# Altium project display.PRJPCB
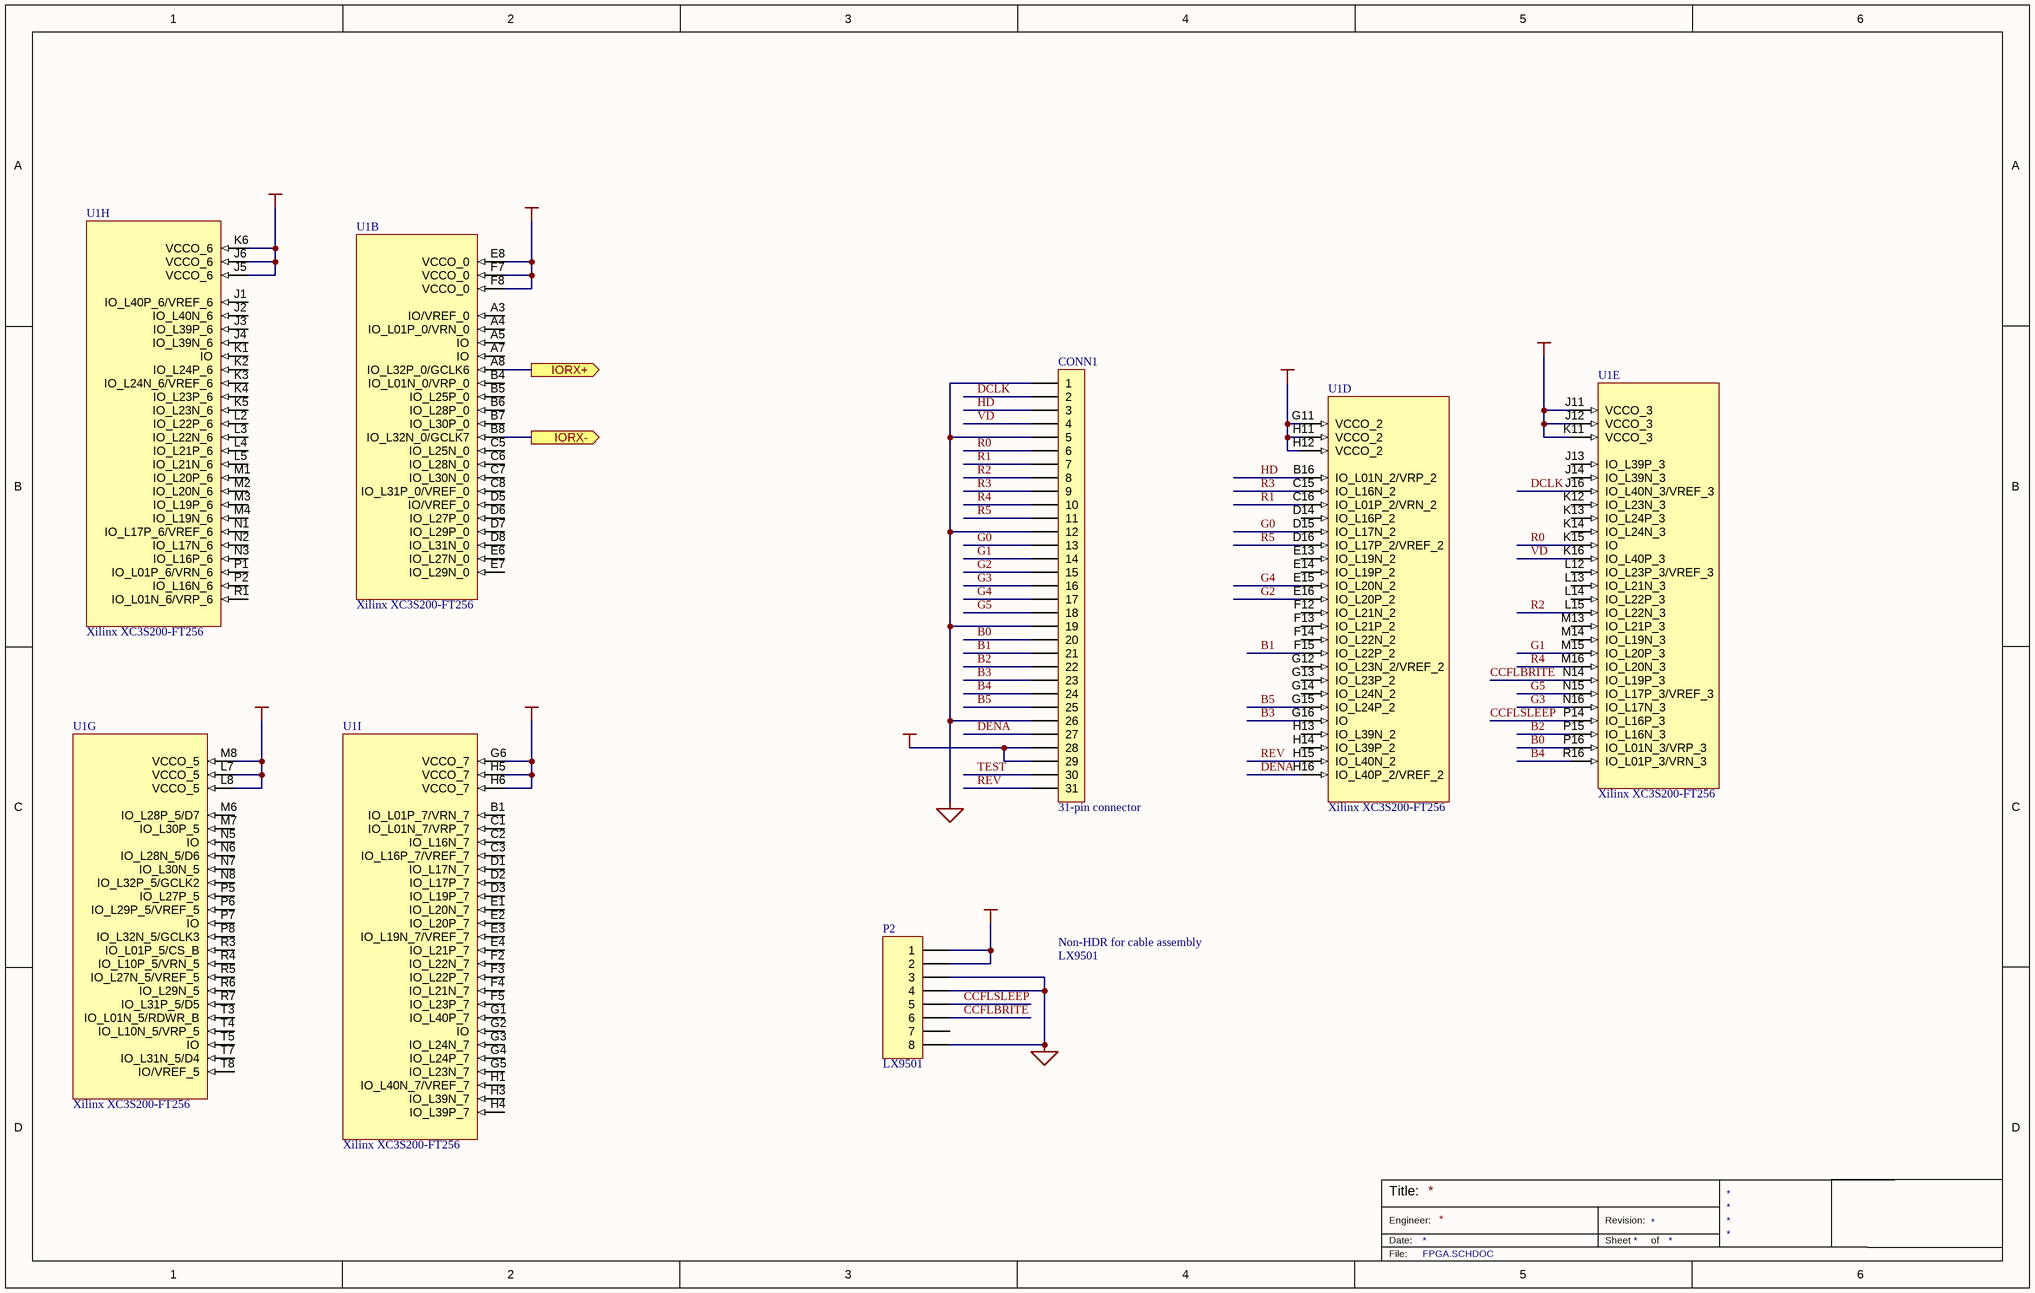
[diagram p0: FPGA.SCHDOC]
3 sheets, 66 parts. Net scope: flat (ports and power ports of the same name join across sheets).
Board file: display.PCBDOC
Sheets:
  FPGA.SCHDOC
  power.SCHDOC
  SERIALIO.SCHDOC

## Sheet FPGA.SCHDOC
size B

### Parts
CONN1  31-pin connector  [DF9A-31S-1V]
P2  LX9501  [HDR1X8]
U1  Xilinx XC3S200-FT256  [Xilinx FT256 BGA]  (parts B,D,E,G,H,I of 9)

### Ports
IORX+ (out), IORX- (out)

### Nets
+2.5VCC: U1.E8(VCCO_0) U1.F7(VCCO_0) U1.F8(VCCO_0)
+12VCC: P2.1 P2.2
GND: CONN1.1 CONN1.5 CONN1.12 CONN1.19 CONN1.26 P2.3 P2.4 P2.8
VCC: CONN1.28 CONN1.29 U1.G6(VCCO_7) U1.G11(VCCO_2) U1.H5(VCCO_7) U1.H6(VCCO_7) U1.H11(VCCO_2) U1.H12(VCCO_2) U1.J5(VCCO_6) U1.J6(VCCO_6) U1.J11(VCCO_3) U1.J12(VCCO_3) U1.K6(VCCO_6) U1.K11(VCCO_3) U1.L7(VCCO_5) U1.L8(VCCO_5) U1.M8(VCCO_5)
B0: CONN1.20 U1.P16(IO_L01N_3/VRP_3)
B1: CONN1.21 U1.F15(IO_L22P_2)
B2: CONN1.22 U1.P15(IO_L16N_3)
B3: CONN1.23 U1.G16(IO)
B4: CONN1.24 U1.R16(IO_L01P_3/VRN_3)
B5: CONN1.25 U1.G15(IO_L24P_2)
CCFLBRITE: P2.6 U1.N14(IO_L19P_3)
CCFLSLEEP: P2.5 U1.P14(IO_L16P_3)
DCLK: CONN1.2 U1.J16(IO_L40N_3/VREF_3)
DENA: CONN1.27 U1.H16(IO_L40P_2/VREF_2)
G0: CONN1.13 U1.D15(IO_L17N_2)
G1: CONN1.14 U1.M15(IO_L20P_3)
G2: CONN1.15 U1.E16(IO_L20P_2)
G3: CONN1.16 U1.N16(IO_L17N_3)
G4: CONN1.17 U1.E15(IO_L20N_2)
G5: CONN1.18 U1.N15(IO_L17P_3/VREF_3)
HD: CONN1.3 U1.B16(IO_L01N_2/VRP_2)
IORX+: U1.A8(IO_L32P_0/GCLK6) ; port IORX+
IORX-: U1.B8(IO_L32N_0/GCLK7) ; port IORX-
R0: CONN1.6 U1.K15(IO)
R1: CONN1.7 U1.C16(IO_L01P_2/VRN_2)
R2: CONN1.8 U1.L15(IO_L22N_3)
R3: CONN1.9 U1.C15(IO_L16N_2)
R4: CONN1.10 U1.M16(IO_L20N_3)
R5: CONN1.11 U1.D16(IO_L17P_2/VREF_2)
REV: CONN1.31 U1.H15(IO_L40N_2)
TEST: CONN1.30
VD: CONN1.4 U1.K16(IO_L40P_3)

Not connected (* = marked no-connect by the designer): P2 7; U1 A3(IO/VREF_0) A4(IO_L01P_0/VRN_0) A5(IO) A7(IO) B1(IO_L01P_7/VRN_7) B4(IO_L01N_0/VRP_0) B5(IO_L25P_0) B6(IO_L28P_0) B7(IO_L30P_0) C1(IO_L01N_7/VRP_7) C2(IO_L16N_7) C3(IO_L16P_7/VREF_7) C5(IO_L25N_0) C6(IO_L28N_0) C7(IO_L30N_0) C8(IO_L31P_0/VREF_0) D1(IO_L17N_7) D2(IO_L17P_7) D3(IO_L19P_7) D5(IO/VREF_0) D6(IO_L27P_0) D7(IO_L29P_0) D8(IO_L31N_0) D14(IO_L16P_2) E1(IO_L20N_7) E2(IO_L20P_7) E3(IO_L19N_7/VREF_7) E4(IO_L21P_7) E6(IO_L27N_0) E7(IO_L29N_0) E13(IO_L19N_2) E14(IO_L19P_2) F2(IO_L22N_7) F3(IO_L22P_7) F4(IO_L21N_7) F5(IO_L23P_7) F12(IO_L21N_2) F13(IO_L21P_2) F14(IO_L22N_2) G1(IO_L40P_7) G2(IO) G3(IO_L24N_7) G4(IO_L24P_7) G5(IO_L23N_7) G12(IO_L23N_2/VREF_2) G13(IO_L23P_2) G14(IO_L24N_2) H1(IO_L40N_7/VREF_7) H3(IO_L39N_7) H4(IO_L39P_7) H13(IO_L39N_2) H14(IO_L39P_2) J1(IO_L40P_6/VREF_6) J2(IO_L40N_6) J3(IO_L39P_6) J4(IO_L39N_6) J13(IO_L39P_3) J14(IO_L39N_3) K1(IO) K2(IO_L24P_6) K3(IO_L24N_6/VREF_6) K4(IO_L23P_6) K5(IO_L23N_6) K12(IO_L23N_3) K13(IO_L24P_3) K14(IO_L24N_3) L2(IO_L22P_6) L3(IO_L22N_6) L4(IO_L21P_6) L5(IO_L21N_6) L12(IO_L23P_3/VREF_3) L13(IO_L21N_3) L14(IO_L22P_3) M1(IO_L20P_6) M2(IO_L20N_6) M3(IO_L19P_6) M4(IO_L19N_6) M6(IO_L28P_5/D7) M7(IO_L30P_5) M13(IO_L21P_3) M14(IO_L19N_3) N1(IO_L17P_6/VREF_6) N2(IO_L17N_6) N3(IO_L16P_6) N5(IO) N6(IO_L28N_5/D6) N7(IO_L30N_5) N8(IO_L32P_5/GCLK2) P1(IO_L01P_6/VRN_6) P2(IO_L16N_6) P5(IO_L27P_5) P6(IO_L29P_5/VREF_5) P7(IO) P8(IO_L32N_5/GCLK3) R1(IO_L01N_6/VRP_6) R3(IO_L01P_5/CS_B) R4(IO_L10P_5/VRN_5) R5(IO_L27N_5/VREF_5) R6(IO_L29N_5) R7(IO_L31P_5/D5) T3(IO_L01N_5/RDWR_B) T4(IO_L10N_5/VRP_5) T5(IO) T7(IO_L31N_5/D4) T8(IO/VREF_5)

### Notes on the sheet
- Non-HDR for cable assembly
- LX9501
- Title:
- Engineer:
- Date:
- Revision:
- Sheet
- of
- File:

### Library data of the parts
CONN1 = CON31
P2 = Header 8: Header, 8-Pin; LatestRevisionDate: 17-Jul-2002; LatestRevisionNote: Re-released for DXP Platform.; Publisher: Altium Limited
U1 = XC3S200-FT256: Xilinx Spartan-3 FPGA

## Sheet power.SCHDOC
size B; PageSetup: Record=PageOptions|CenterHorizontal=True|CenterVertical=True|PrintScale=1.09|XCorrection=1.00|YCorrection=1.00|PrintKind=1|BorderSize=5000000|LeftOffset=0|BottomOffset=0|Orientation=2|PaperLength=1000|PaperWidth=1000|Scale=100|PaperSource=15|PrintQuality=600|MediaType=1|DitherType=10|PaperKind=11x17|PrintScaleMode=1
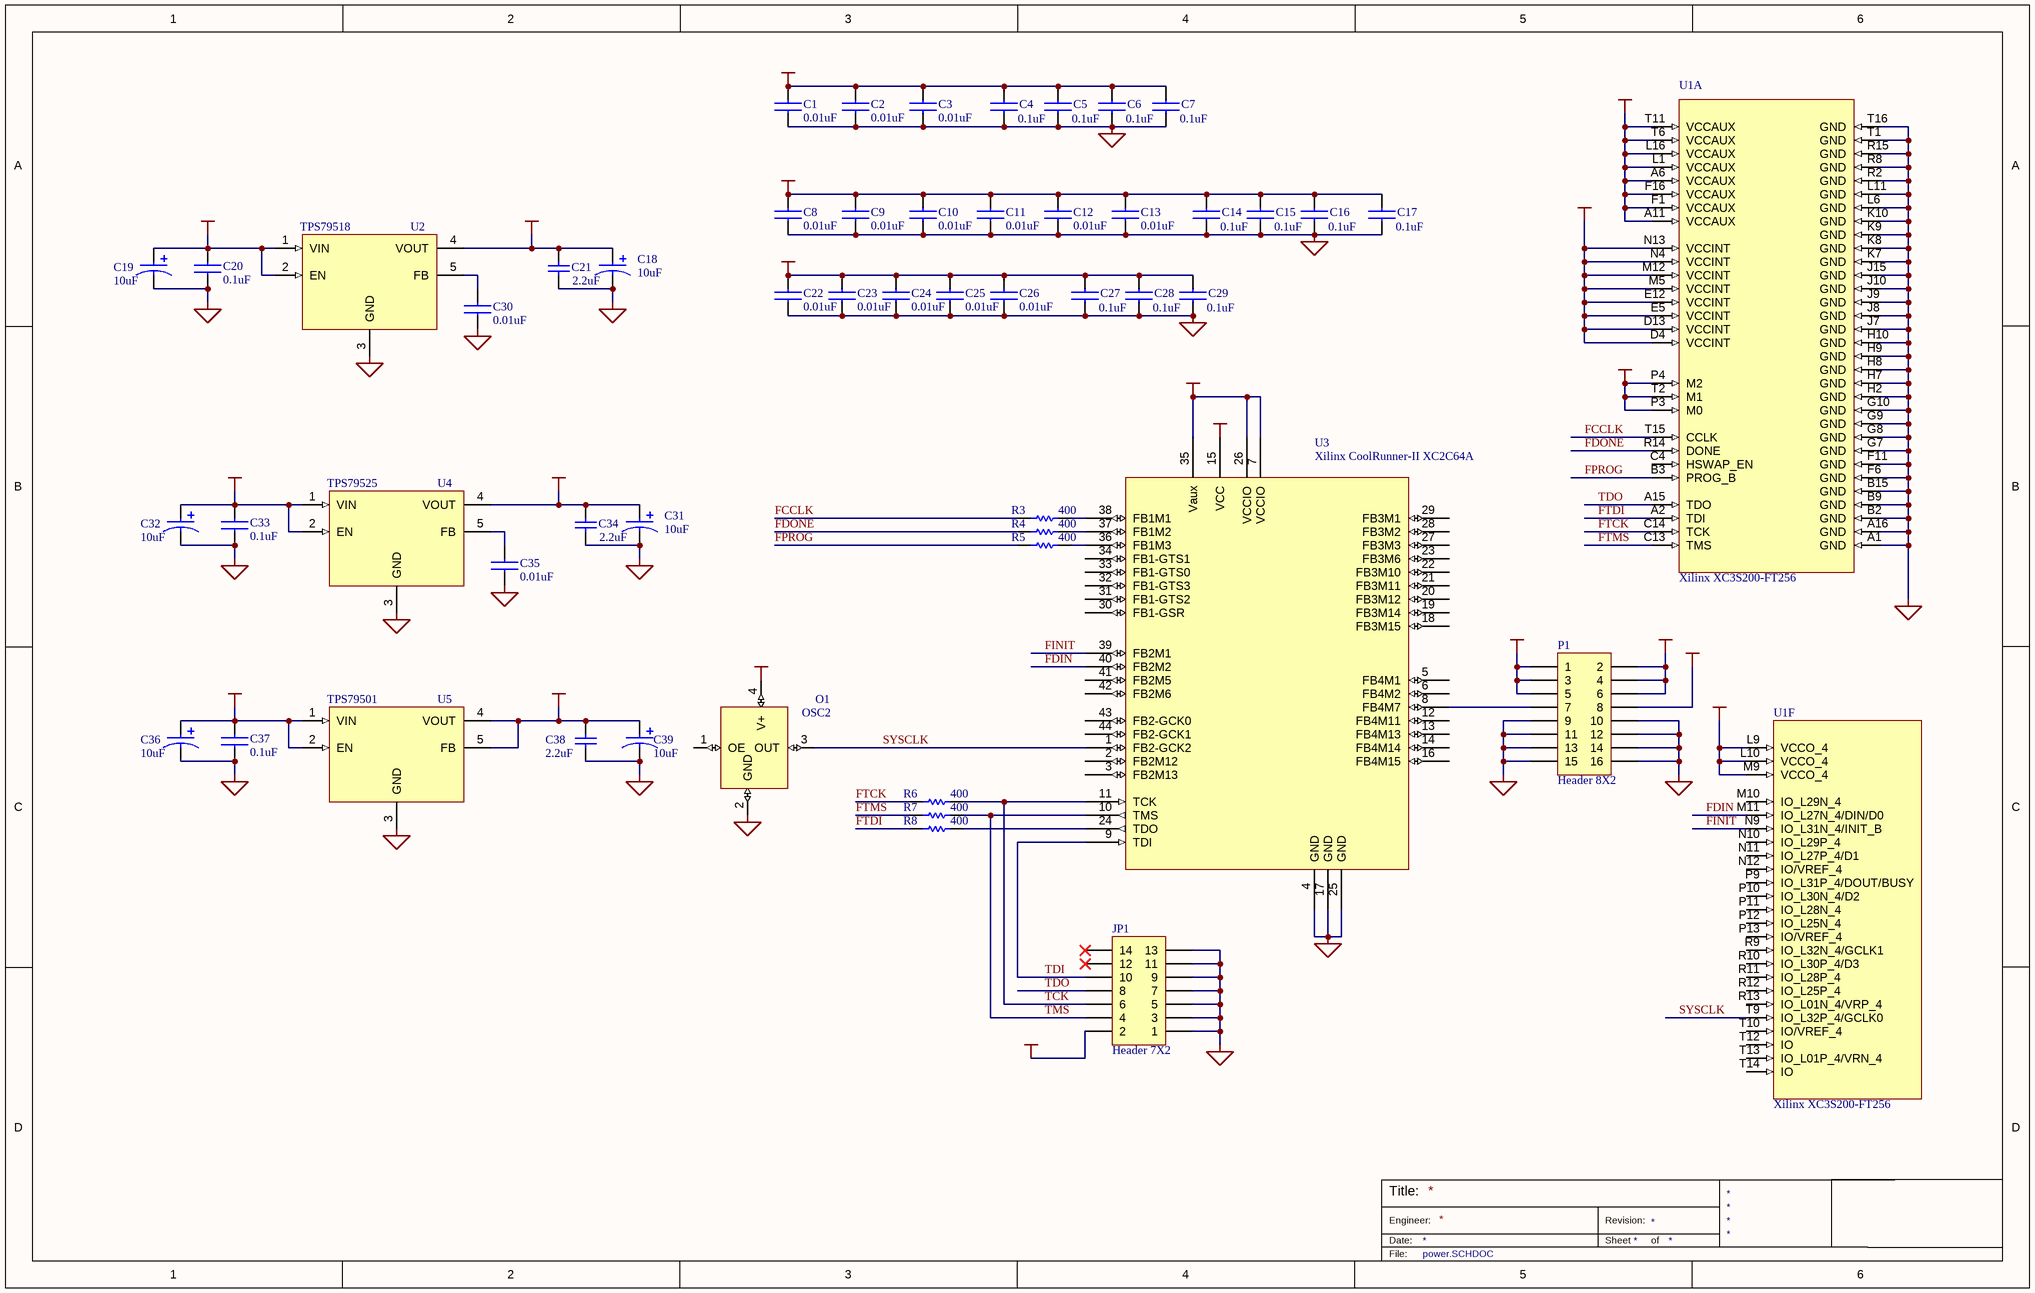
[diagram p1: power.SCHDOC]

### Parts
C1  value 0.01uF  [0402]  (hidden comment: CAPACITOR)
C2  value 0.01uF  [0402]  (hidden comment: CAPACITOR)
C3  value 0.01uF  [0402]  (hidden comment: CAPACITOR)
C4  value 0.1uF  [0603]  (hidden comment: CAPACITOR)
C5  value 0.1uF  [0603]  (hidden comment: CAPACITOR)
C6  value 0.1uF  [0603]  (hidden comment: CAPACITOR)
C7  value 0.1uF  [0603]  (hidden comment: CAPACITOR)
C8  value 0.01uF  [0402]  (hidden comment: CAPACITOR)
C9  value 0.01uF  [0402]  (hidden comment: CAPACITOR)
C10  value 0.01uF  [0402]  (hidden comment: CAPACITOR)
C11  value 0.01uF  [0402]  (hidden comment: CAPACITOR)
C12  value 0.01uF  [0402]  (hidden comment: CAPACITOR)
C13  value 0.01uF  [0402]  (hidden comment: CAPACITOR)
C14  value 0.1uF  [0603]  (hidden comment: CAPACITOR)
C15  value 0.1uF  [0603]  (hidden comment: CAPACITOR)
C16  value 0.1uF  [0603]  (hidden comment: CAPACITOR)
C17  value 0.1uF  [0603]  (hidden comment: CAPACITOR)
C18  value 10uF  [6032]  (hidden comment: POLCAP2)
C19  value 10uF  [6032]  (hidden comment: POLCAP2)
C20  value 0.1uF  [0603]  (hidden comment: CAPACITOR)
C21  value 2.2uF  [1206]  (hidden comment: Cap)
C22  value 0.01uF  [0402]  (hidden comment: CAPACITOR)
C23  value 0.01uF  [0402]  (hidden comment: CAPACITOR)
C24  value 0.01uF  [0402]  (hidden comment: CAPACITOR)
C25  value 0.01uF  [0402]  (hidden comment: CAPACITOR)
C26  value 0.01uF  [0402]  (hidden comment: CAPACITOR)
C27  value 0.1uF  [0603]  (hidden comment: CAPACITOR)
C28  value 0.1uF  [0603]  (hidden comment: CAPACITOR)
C29  value 0.1uF  [0603]  (hidden comment: CAPACITOR)
C30  value 0.01uF  [0402]  (hidden comment: CAPACITOR)
C31  value 10uF  [6032]  (hidden comment: POLCAP2)
C32  value 10uF  [6032]  (hidden comment: POLCAP2)
C33  value 0.1uF  [0603]  (hidden comment: CAPACITOR)
C34  value 2.2uF  [1206]  (hidden comment: Cap)
C35  value 0.01uF  [0402]  (hidden comment: CAPACITOR)
C36  value 10uF  [6032]  (hidden comment: POLCAP2)
C37  value 0.1uF  [0603]  (hidden comment: CAPACITOR)
C38  value 2.2uF  [1206]  (hidden comment: Cap)
C39  value 10uF  [6032]  (hidden comment: POLCAP2)
JP1  Header 7X2  [SMT 2x7 2mm HDR]
O1  OSC2  [ECS-3953M]
P1  Header 8X2  [MOLEX 15-91-2160]
R3  value 400  [CC1608-0603]  (hidden comment: current-limiting series res)
R4  value 400  [CC1608-0603]  (hidden comment: current-limiting series res)
R5  value 400  [CC1608-0603]  (hidden comment: current-limiting series res)
R6  value 400  [CC1608-0603]  (hidden comment: current-limiting series res)
R7  value 400  [CC1608-0603]  (hidden comment: current-limiting series res)
R8  value 400  [CC1608-0603]  (hidden comment: current-limiting series res)
U1  Xilinx XC3S200-FT256  [Xilinx FT256 BGA]  (parts A,F of 9)
U2  TPS79518  [SOT223-5/Simple]
U3  Xilinx CoolRunner-II XC2C64A  [QFP10x10-G44/G10N]
U4  TPS79525  [SOT223-5/Simple]
U5  TPS79501  [SOT223-5/Simple]

### Nets
+1.2VCC: C1.1 C2.1 C3.1 C4.1 C5.1 C6.1 C7.1 C38.2 C39.1 U1.D4(VCCINT) U1.D13(VCCINT) U1.E5(VCCINT) U1.E12(VCCINT) U1.M5(VCCINT) U1.M12(VCCINT) U1.N4(VCCINT) U1.N13(VCCINT) U5.4(VOUT) U5.5(FB)
+1.8VCC: C18.1 C21.2 U2.4(VOUT) U3.15(VCC)
+2.5VCC: C8.1 C9.1 C10.1 C11.1 C12.1 C13.1 C14.1 C15.1 C16.1 C17.1 C31.1 C34.2 U1.A6(VCCAUX) U1.A11(VCCAUX) U1.F1(VCCAUX) U1.F16(VCCAUX) U1.L1(VCCAUX) U1.L16(VCCAUX) U1.T6(VCCAUX) U1.T11(VCCAUX) U4.4(VOUT)
+5VCC: P1.2 P1.4 P1.6
+12VCC: P1.8
GND: C1.2 C2.2 C3.2 C4.2 C5.2 C6.2 C7.2 C8.2 C9.2 C10.2 C11.2 C12.2 C13.2 C14.2 C15.2 C16.2 C17.2 C18.2 C19.2 C20.1 C21.1 C22.2 C23.2 C24.2 C25.2 C26.2 C27.2 C28.2 C29.2 C30.1 C31.2 C32.2 C33.1 C34.1 C35.1 C36.2 C37.1 C38.1 C39.2 JP1.1 JP1.3 JP1.5 JP1.7 JP1.9 JP1.11 JP1.13 O1.2(GND) P1.9 P1.10 P1.11 P1.12 P1.13 P1.14 P1.15 P1.16 U1.A1(GND) U1.A16(GND) U1.B2(GND) U1.B9(GND) U1.B15(GND) U1.F6(GND) U1.F11(GND) U1.G7(GND) U1.G8(GND) U1.G9(GND) U1.G10(GND) U1.H2(GND) U1.H7(GND) U1.H8(GND) U1.H9(GND) U1.H10(GND) U1.J7(GND) U1.J8(GND) U1.J9(GND) U1.J10(GND) U1.J15(GND) U1.K7(GND) U1.K8(GND) U1.K9(GND) U1.K10(GND) U1.L6(GND) U1.L11(GND) U1.R2(GND) U1.R8(GND) U1.R15(GND) U1.T1(GND) U1.T16(GND) U2.3(GND) U3.4(GND) U3.17(GND) U3.25(GND) U4.3(GND) U5.3(GND)
VCC: C19.1 C20.2 C22.1 C23.1 C24.1 C25.1 C26.1 C27.1 C28.1 C29.1 C32.1 C33.2 C36.1 C37.2 JP1.2 O1.4(V+) P1.1 P1.3 P1.5 U1.L9(VCCO_4) U1.L10(VCCO_4) U1.M9(VCCO_4) U1.P3(M0) U1.P4(M2) U1.T2(M1) U2.1(VIN) U2.2(EN) U3.7(VCCIO) U3.26(VCCIO) U3.35(Vaux) U4.1(VIN) U4.2(EN) U5.1(VIN) U5.2(EN)
FCCLK: R3.2 U1.T15(CCLK)
FDIN: U1.M11(IO_L27N_4/DIN/D0) U3.40(FB2M2)
FDONE: R4.2 U1.R14(DONE)
FINIT: U1.N9(IO_L31N_4/INIT_B) U3.39(FB2M1)
FPROG: R5.2 U1.B3(PROG_B)
FTCK: R6.2 U1.C14(TCK)
FTDI: R8.2 U1.A2(TDI)
FTMS: R7.1 U1.C13(TMS)
SYSCLK: O1.3(OUT) U1.T9(IO_L32P_4/GCLK0) U3.1(FB2-GCK2)
TCK: JP1.6 R6.1 U3.11(TCK)
TDI: JP1.10 U3.9(TDI)
TDO: JP1.8 U1.A15(TDO)
TMS: JP1.4 R7.2 U3.10(TMS)
NetC30_2: C30.2 U2.5(FB)
NetC35_2: C35.2 U4.5(FB)
NetP1_7: P1.7 U3.8(FB4M7)
NetR3_1: R3.1 U3.38(FB1M1)
NetR4_1: R4.1 U3.37(FB1M2)
NetR5_1: R5.1 U3.36(FB1M3)
NetR8_1: R8.1 U3.24(TDO)

Not connected (* = marked no-connect by the designer): JP1 12* 14*; O1 1(OE); U1 C4(HSWAP_EN) M10(IO_L29N_4) N10(IO_L29P_4) N11(IO_L27P_4/D1) N12(IO/VREF_4) P9(IO_L31P_4/DOUT/BUSY) P10(IO_L30N_4/D2) P11(IO_L28N_4) P12(IO_L25N_4) P13(IO/VREF_4) R9(IO_L32N_4/GCLK1) R10(IO_L30P_4/D3) R11(IO_L28P_4) R12(IO_L25P_4) R13(IO_L01N_4/VRP_4) T10(IO/VREF_4) T12(IO) T13(IO_L01P_4/VRN_4) T14(IO); U3 2(FB2M12) 3(FB2M13) 5(FB4M1) 6(FB4M2) 12(FB4M11) 13(FB4M13) 14(FB4M14) 16(FB4M15) 18(FB3M15) 19(FB3M14) 20(FB3M12) 21(FB3M11) 22(FB3M10) 23(FB3M6) 27(FB3M3) 28(FB3M2) 29(FB3M1) 30(FB1-GSR) 31(FB1-GTS2) 32(FB1-GTS3) 33(FB1-GTS0) 34(FB1-GTS1) 41(FB2M5) 42(FB2M6) 43(FB2-GCK0) 44(FB2-GCK1)

### Notes on the sheet
- Title:
- Engineer:
- Date:
- Revision:
- Sheet
- of
- File:

### Library data of the parts
C1-C17 C22-C29 = CAPACITOR: Standard Capacitor; Type: X7R
C18 C19 C31 C32 C36 C39 = POLCAP2: Standard Capacitor
C20 C30 C33 C35 C37 = CAPACITOR: Standard Capacitor
C21 C34 C38 = Cap: Capacitor; Manufacturer: Generic Components; Class I: Passive; Published: 8-Jun-2000; Revision: July-2002: Re-released for DXP Platform.; Publisher: Altium Limited; Class II: Capacitor
JP1 = Header 7X2: Header, 7-Pin, Dual row; Manufacturer: Generic Components; Class I: Connector; Revision: July-2002: Re-released for DXP Platform.; Publisher: Altium Limited
O1 = OSC2: ECS SMD Oscillator, ECS-3953M
P1 = Header 8X2: Header, 8-Pin, Dual row; LatestRevisionDate: 17-Jul-2002; LatestRevisionNote: Re-released for DXP Platform.; Publisher: Altium Limited
R3-R8 = Res1: Resistor; Manufacturer: Generic Components; Class I: Passive; Published: 8-Jun-2000; Revision: July-2002: Re-released for DXP Platform.; Publisher: Altium Limited; Class II: Resistor
U1 = XC3S200-FT256: Xilinx Spartan-3 FPGA
U2 U4 U5 = TPS795XX: TI Ultra-low-noise LDO
U3 = XC2C64A-5VQ44C

## Sheet SERIALIO.SCHDOC
size B
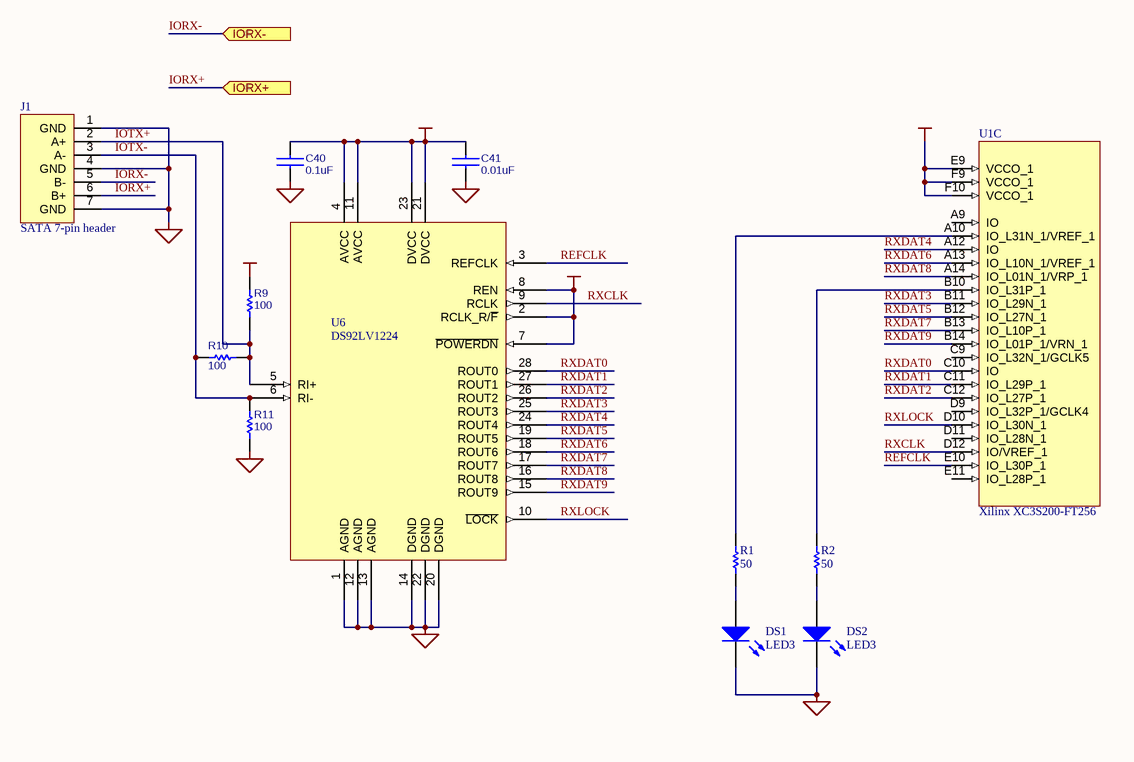
[diagram p2: SERIALIO.SCHDOC]

### Parts
C40  value 0.1uF  [0603]  (hidden comment: CAPACITOR)
C41  value 0.01uF  [0402]  (hidden comment: CAPACITOR)
DS1  LED3  [SMD _LED]
DS2  LED3  [SMD _LED]
J1  SATA 7-pin header  [MOLES 67800-5005]
R1  value 50  [0603]  (hidden comment: current-limiting series res)
R2  value 50  [0603]  (hidden comment: current-limiting series res)
R9  100  [0603]
R10  100  [0603]
R11  100  [0603]
U1  Xilinx XC3S200-FT256  [Xilinx FT256 BGA]  (part C of 9)
U6  DS92LV1224  [SSO-G28/E4.3]

### Ports
IORX+ (in), IORX- (in)

### Nets
GND: C40.1 C41.1 DS1.2(K) DS2.2(K) J1.1(GND) J1.4(GND) J1.7(GND) R11.1 U6.1(AGND) U6.12(AGND) U6.13(AGND) U6.14(DGND) U6.20(DGND) U6.22(DGND)
VCC: C40.2 C41.2 R9.1 U1.E9(VCCO_1) U1.F9(VCCO_1) U1.F10(VCCO_1) U6.2(RCLK_R/~{F}) U6.4(AVCC) U6.7(~{POWERDN}) U6.8(REN) U6.11(AVCC) U6.21(DVCC) U6.23(DVCC)
IORX+: J1.6(B+) ; port IORX+
IORX-: J1.5(B-) ; port IORX-
IOTX+: J1.2(A+) R9.2 R10.2 U6.5(RI+)
IOTX-: J1.3(A-) R10.1 R11.2 U6.6(RI-)
REFCLK: U1.E10(IO_L30P_1) U6.3(REFCLK)
RXCLK: U1.D12(IO/VREF_1) U6.9(RCLK)
RXDAT0: U1.C10(IO) U6.28(ROUT0)
RXDAT1: U1.C11(IO_L29P_1) U6.27(ROUT1)
RXDAT2: U1.C12(IO_L27P_1) U6.26(ROUT2)
RXDAT3: U1.B11(IO_L29N_1) U6.25(ROUT3)
RXDAT4: U1.A12(IO) U6.24(ROUT4)
RXDAT5: U1.B12(IO_L27N_1) U6.19(ROUT5)
RXDAT6: U1.A13(IO_L10N_1/VREF_1) U6.18(ROUT6)
RXDAT7: U1.B13(IO_L10P_1) U6.17(ROUT7)
RXDAT8: U1.A14(IO_L01N_1/VRP_1) U6.16(ROUT8)
RXDAT9: U1.B14(IO_L01P_1/VRN_1) U6.15(ROUT9)
RXLOCK: U1.D10(IO_L30N_1) U6.10(~{LOCK})
NetDS1_1: DS1.1(A) R1.2
NetDS2_1: DS2.1(A) R2.2
NetR1_1: R1.1 U1.A10(IO_L31N_1/VREF_1)
NetR2_1: R2.1 U1.B10(IO_L31P_1)

Not connected (* = marked no-connect by the designer): U1 A9(IO) C9(IO_L32N_1/GCLK5) D9(IO_L32P_1/GCLK4) D11(IO_L28N_1) E11(IO_L28P_1)

### Notes on the sheet
- Title:
- Engineer:
- Date:
- Revision:
- Sheet
- of
- File:

### Library data of the parts
C40 C41 = CAPACITOR: Standard Capacitor
DS1 DS2 = LED3: Typical BLUE SiC LED; Published: 8-Jun-2000; LatestRevisionDate: 17-Dec-2003; LatestRevisionNote: PCB Footprint replaced.; Publisher: Altium Limited
J1 = SATA-7
R1 R2 = RESISTOR: Standard Passive Resistor
R9-R11 = RESISTOR: Standard Passive Resistor; Value: TERMVALUE
U1 = XC3S200-FT256: Xilinx Spartan-3 FPGA
U6 = DS92LV1224: 30-66 MHz 10-Bit Bus LVDS Deserializer

## Nets that join several sheets
+2.5VCC: FPGA (U1.E8 U1.F7 U1.F8), power (21 pins)
+12VCC: FPGA (P2.1 P2.2), power (P1.8)
GND: FPGA (8 pins), power (93 pins), SERIALIO (14 pins)
VCC: FPGA (17 pins), power (34 pins), SERIALIO (13 pins)
IORX+: FPGA (U1.A8), SERIALIO (J1.6)
IORX-: FPGA (U1.B8), SERIALIO (J1.5)